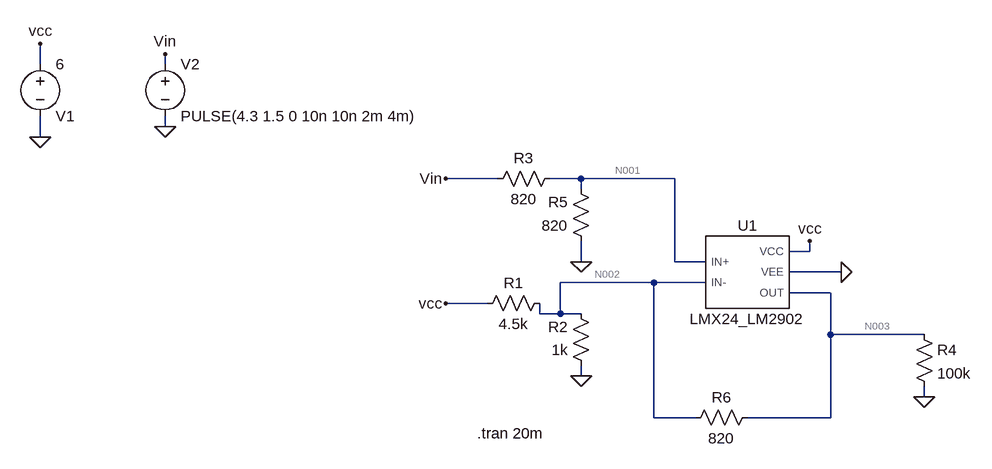
[diagram p0: schematic Differential.asc]
Differential.asc, the LTspice schematic file:
Version 4
SHEET 1 880 680
WIRE -720 -144 -720 -176
WIRE -528 -144 -528 -160
WIRE -528 -48 -528 -64
WIRE -720 -32 -720 -64
WIRE -16 32 -96 32
WIRE 112 32 64 32
WIRE 256 32 112 32
WIRE 112 48 112 32
WIRE 464 144 464 128
WIRE 464 144 432 144
WIRE 112 160 112 128
WIRE 256 160 256 32
WIRE 304 160 256 160
WIRE 512 176 432 176
WIRE 224 192 80 192
WIRE 304 192 224 192
WIRE 496 208 432 208
WIRE -32 224 -96 224
WIRE 48 240 48 224
WIRE 80 240 80 192
WIRE 80 240 48 240
WIRE 112 240 80 240
WIRE 496 272 496 208
WIRE 640 272 496 272
WIRE 112 336 112 320
WIRE 640 368 640 352
WIRE 224 400 224 192
WIRE 288 400 224 400
WIRE 496 400 496 272
WIRE 496 400 368 400
FLAG 112 160 0
FLAG 640 368 0
FLAG -720 -32 0
FLAG -720 -176 vcc
FLAG 464 128 vcc
FLAG 512 176 0
FLAG 112 336 0
FLAG -528 -48 0
FLAG -528 -160 Vin
FLAG -96 224 vcc
FLAG -96 32 Vin
SYMBOL voltage -720 -160 R0
WINDOW 0 24 96 Left 2
WINDOW 3 24 16 Left 2
WINDOW 123 0 0 Left 0
WINDOW 39 0 0 Left 0
SYMATTR InstName V1
SYMATTR Value 6
SYMBOL res 64 208 R90
WINDOW 0 0 56 VBottom 2
WINDOW 3 32 56 VTop 2
SYMATTR InstName R1
SYMATTR Value 4.5k
SYMBOL res 128 336 R180
WINDOW 0 36 76 Left 2
WINDOW 3 36 40 Left 2
SYMATTR InstName R2
SYMATTR Value 1k
SYMBOL LMX24_LM2902 368 176 R0
SYMATTR InstName U1
SYMBOL res 80 16 R90
WINDOW 0 0 56 VBottom 2
WINDOW 3 32 56 VTop 2
SYMATTR InstName R3
SYMATTR Value 820
SYMBOL res 624 256 R0
SYMATTR InstName R4
SYMATTR Value 100k
SYMBOL res 128 144 R180
WINDOW 0 36 76 Left 2
WINDOW 3 36 40 Left 2
SYMATTR InstName R5
SYMATTR Value 820
SYMBOL voltage -528 -160 R0
WINDOW 123 0 0 Left 0
WINDOW 39 0 0 Left 0
SYMATTR InstName V2
SYMATTR Value PULSE(4.3 1.5 0 10n 10n 2m 4m)
SYMBOL res 272 416 R270
WINDOW 0 32 56 VTop 2
WINDOW 3 0 56 VBottom 2
SYMATTR InstName R6
SYMATTR Value 820
TEXT -48 424 Left 2 !.tran 20m

The netlist it stands for:
* Differential.asc
V1 vcc 0 6
R1 N002 vcc 4.5k
R2 0 N002 1k
XU1 N001 N002 vcc 0 N003 LMX24_LM2902  ; pins IN+ IN- VCC VEE OUT
R3 N001 Vin 820
R4 N003 0 100k
R5 0 N001 820
V2 Vin 0 PULSE(4.3 1.5 0 10n 10n 2m 4m)
R6 N002 N003 820
.tran 20m
.lib Z:\home\david\Documents\LTspice\PCB_filter\LMx24\lmx24_lm2902.lib
.backanno
.end

* Results of the author's LTspice run, read from the files saved beside the schematic
* Operating Point, zero values left out:
*   V(vcc) = 6 V
*   V(n002) = 2.152 V
*   V(n003) = 3.215 V
*   V(n001) = 2.15 V
*   V(vin) = 4.3 V
*   I(R1) = -855.1 µA
*   I(R2) = -2.152 mA
*   I(R3) = -2.622 mA
*   I(R4) = 32.15 µA
*   I(R5) = -2.622 mA
*   I(R6) = -1.297 mA
*   I(V1) = -2.359 mA
*   I(V2) = -2.622 mA
*   Ix(u1:IN+) = -20 nA
*   Ix(u1:IN-) = -18 nA
*   Ix(u1:VCC) = 1.504 mA
*   Ix(u1:VEE) = -175 µA
*   Ix(u1:OUT) = -1.329 mA
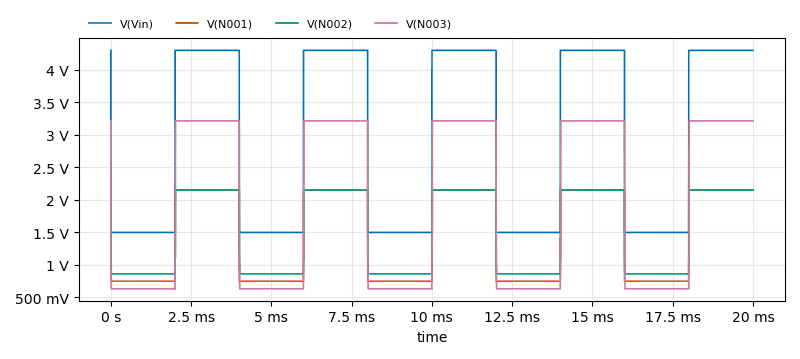
[diagram p1: Transient Analysis of Differential.asc, plotted from the saved traces]
* Transient Analysis, 1 run:
*   V(Vin): min 1.5 V, max 4.3 V, average 2.9 V, rms 3.22 V, last 4.3 V
*   V(N001): min 749.9 mV, max 2.15 V, average 1.45 V, rms 1.61 V, last 2.15 V
*   V(N002): min 862.3 mV, max 2.152 V, average 1.505 V, rms 1.637 V, last 2.152 V
*   V(N003): min 633.1 mV, max 3.215 V, average 1.92 V, rms 2.313 V, last 3.215 V